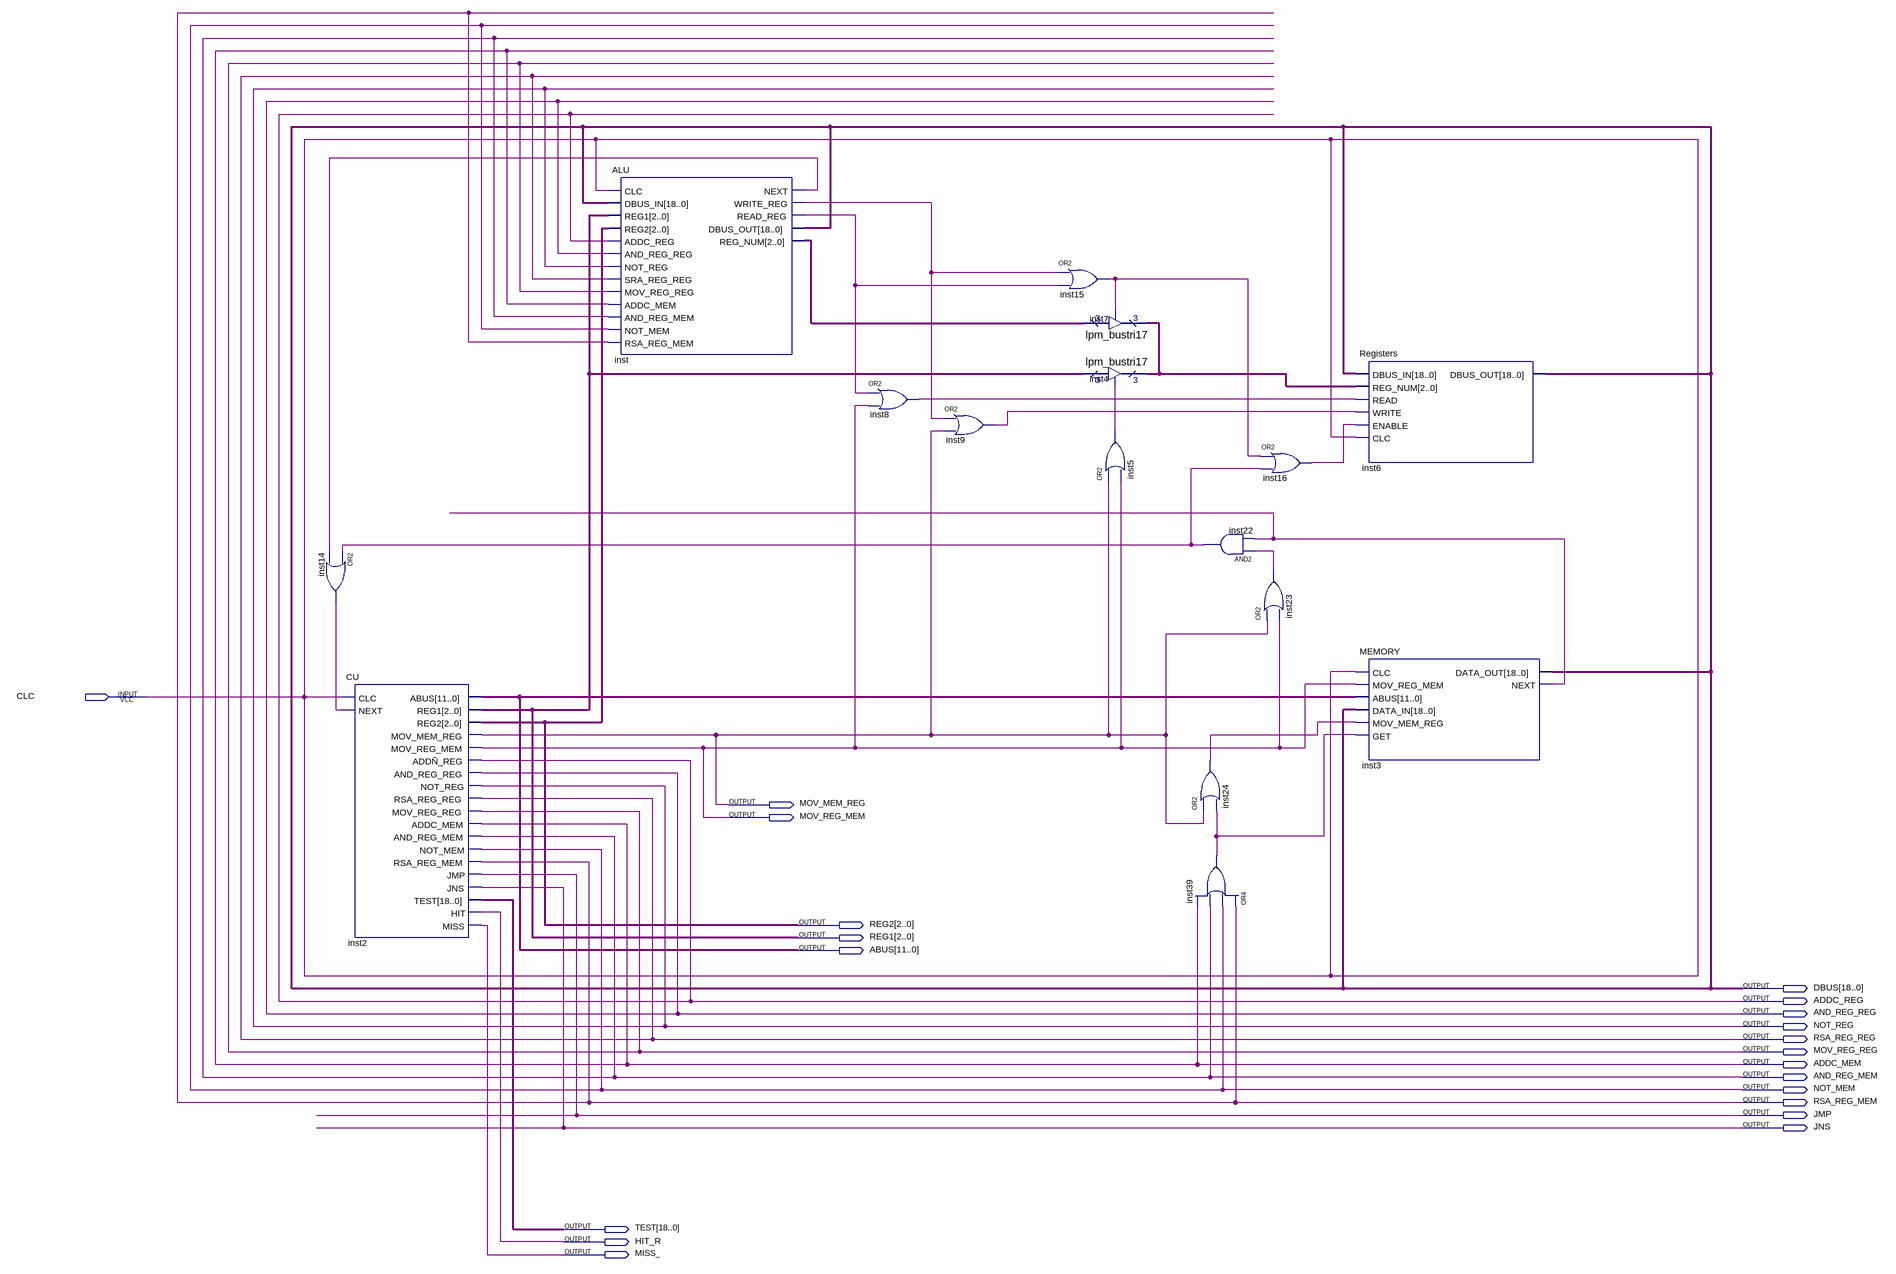
[diagram p0: schematic sheet]
// Quartus schematic course-project.bdf as structural Verilog: 16 symbols, 21 pins
module \course-project  (
  input  CLC,
  output MOV_MEM_REG,
  output MOV_REG_MEM,
  output [2:0] REG2,
  output [2:0] REG1,
  output [11:0] ABUS,
  output [18:0] DBUS,
  output ADDC_REG,
  output AND_REG_REG,
  output NOT_REG,
  output RSA_REG_REG,
  output MOV_REG_REG,
  output ADDC_MEM,
  output AND_REG_MEM,
  output NOT_MEM,
  output RSA_REG_MEM,
  output JMP,
  output JNS,
  output [18:0] TEST,
  output HIT_R,
  output MISS_
);

  wire inst3_next, inst5_out, inst8_out, inst9_out, inst14_out, inst15_out, inst16_out, inst22_out,
       inst23_out, inst24_out, inst39_out, inst_next, inst_read_reg, inst_write_reg;
  wire [2:0] inst7_tridata, inst_reg_num;

  or inst14 (inst14_out, inst22_out, inst_next);
  CU inst2 (
    .CLC(CLC), .NEXT(inst14_out), .ABUS(ABUS), .REG1(REG1), .REG2(REG2), .MOV_MEM_REG(MOV_MEM_REG),
    .MOV_REG_MEM(MOV_REG_MEM), .\ADDÑ_REG (ADDC_REG), .AND_REG_REG(AND_REG_REG), .NOT_REG(NOT_REG),
    .RSA_REG_REG(RSA_REG_REG), .MOV_REG_REG(MOV_REG_REG), .ADDC_MEM(ADDC_MEM), .AND_REG_MEM(AND_REG_MEM),
    .NOT_MEM(NOT_MEM), .RSA_REG_MEM(RSA_REG_MEM), .JMP(JMP), .JNS(JNS), .TEST(TEST), .HIT(HIT_R), .MISS(MISS_));
  ALU inst (
    .CLC(CLC), .DBUS_IN(DBUS), .REG1(REG1), .REG2(REG2), .ADDC_REG(ADDC_REG), .AND_REG_REG(AND_REG_REG),
    .NOT_REG(NOT_REG), .SRA_REG_REG(RSA_REG_REG), .MOV_REG_REG(MOV_REG_REG), .ADDC_MEM(ADDC_MEM),
    .AND_REG_MEM(AND_REG_MEM), .NOT_MEM(NOT_MEM), .RSA_REG_MEM(RSA_REG_MEM), .NEXT(inst_next),
    .WRITE_REG(inst_write_reg), .READ_REG(inst_read_reg), .DBUS_OUT(DBUS), .REG_NUM(inst_reg_num));
  or inst8 (inst8_out, inst_read_reg, MOV_REG_MEM);
  or inst9 (inst9_out, inst_write_reg, MOV_MEM_REG);
  or inst15 (inst15_out, inst_write_reg, inst_read_reg);
  lpm_bustri17 inst7 (.enabledt(inst15_out), .data(inst_reg_num), .tridata(inst7_tridata));
  lpm_bustri17 inst4 (.enabledt(inst5_out), .data(REG1), .tridata(inst7_tridata));
  or inst5 (inst5_out, MOV_MEM_REG, MOV_REG_MEM);
  and inst22 (inst22_out, inst23_out, inst3_next);
  or inst24 (inst24_out, MOV_MEM_REG, inst39_out);
  or inst39 (inst39_out, RSA_REG_MEM, NOT_MEM, AND_REG_MEM, ADDC_MEM);
  or inst16 (inst16_out, inst15_out, inst22_out);
  or inst23 (inst23_out, MOV_MEM_REG, MOV_REG_MEM);
  Registers inst6 (
    .DBUS_IN(DBUS), .REG_NUM(inst7_tridata), .READ(inst8_out), .WRITE(inst9_out), .ENABLE(inst16_out),
    .CLC(CLC), .DBUS_OUT(DBUS));
  MEMORY inst3 (
    .CLC(CLC), .MOV_REG_MEM(MOV_REG_MEM), .ABUS(ABUS), .DATA_IN(DBUS), .MOV_MEM_REG(inst24_out),
    .GET(inst39_out), .DATA_OUT(DBUS), .NEXT(inst3_next));
endmodule
